# Altium project PositionMiniModule.PrjPcb
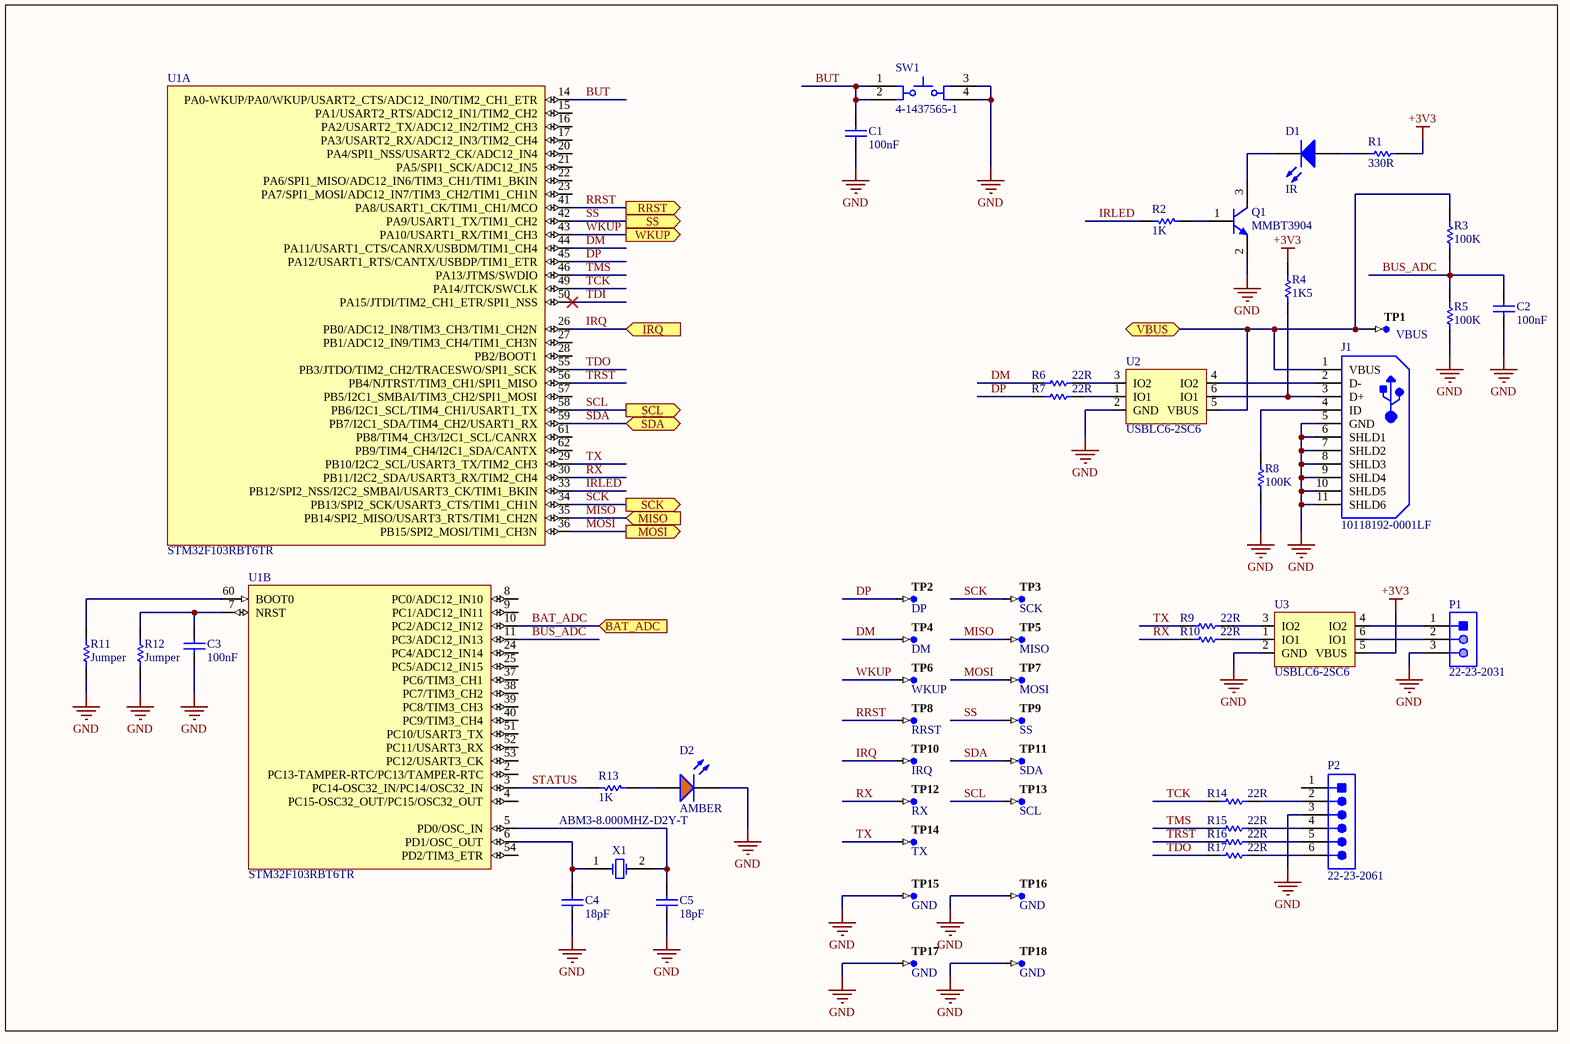
[diagram p0: 1_MCU.SchDoc]
4 sheets, 90 parts. Net scope: flat (ports and power ports of the same name join across sheets).
Board file: PCB.PcbDoc
Sheets:
  1_MCU.SchDoc
  2_Sensors.SchDoc
  3_Radio.SchDoc
  4_Power.SchDoc

## Sheet 1_MCU.SchDoc
size A4

### Parts
C1  100nF  [CAPC0603(1608)100_M]
C2  100nF  [CAPC0603(1608)100_M]
C3  100nF  [CAPC0603(1608)100_M]
C4  18pF  [CAPC0603(1608)100_M]
C5  18pF  [CAPC0603(1608)100_M]
D1  IR  [Type 3mm]
D2  AMBER  [LTST-C171AKT_V]
J1  10118192-0001LF  [FCI-10118192-0001LF-5_V]
P1  22-23-2031  [MOLX-22-23-2031_V]
P2  22-23-2061  [MOLX-22-23-2061_V]
Q1  MMBT3904  [FAIR-SOT23-3_V]
R1  330R  [RESC0603(1608)_M]
R2  1K  [RESC0603(1608)_M]
R3  100K  [RESC0603(1608)_M]
R4  1K5  [RESC0603(1608)_M]
R5  100K  [RESC0603(1608)_M]
R6  22R  [RESC0603(1608)_M]
R7  22R  [RESC0603(1608)_M]
R8  100K  [RESC0603(1608)_M]
R9  22R  [RESC0603(1608)_M]
R10  22R  [RESC0603(1608)_M]
R11  Jumper  [RESC0805(2012)_M]
R12  Jumper  [RESC0805(2012)_M]
R13  1K  [RESC0603(1608)_M]
R14  22R  [RESC0603(1608)_M]
R15  22R  [RESC0603(1608)_M]
R16  22R  [RESC0603(1608)_M]
R17  22R  [RESC0603(1608)_M]
SW1  4-1437565-1  [TECO-4-1437565-1_V]
TP1  VBUS  [TP-SM-C-100]  (no BOM)
TP2  DP  [TP-SM-C-100]  (no BOM)
TP3  SCK  [TP-SM-C-100]  (no BOM)
TP4  DM  [TP-SM-C-100]  (no BOM)
TP5  MISO  [TP-SM-C-100]  (no BOM)
TP6  WKUP  [TP-SM-C-100]  (no BOM)
TP7  MOSI  [TP-SM-C-100]  (no BOM)
TP8  RRST  [TP-SM-C-100]  (no BOM)
TP9  SS  [TP-SM-C-100]  (no BOM)
TP10  IRQ  [TP-SM-C-100]  (no BOM)
TP11  SDA  [TP-SM-C-100]  (no BOM)
TP12  RX  [TP-SM-C-100]  (no BOM)
TP13  SCL  [TP-SM-C-100]  (no BOM)
TP14  TX  [TP-SM-C-100]  (no BOM)
TP15  GND  [TP-SM-C-100]  (no BOM)
TP16  GND  [TP-SM-C-100]  (no BOM)
TP17  GND  [TP-SM-C-100]  (no BOM)
TP18  GND  [TP-SM-C-100]  (no BOM)
U1  STM32F103RBT6TR  [STM-LQFP64_N]  (parts A,B of 3)
U2  USBLC6-2SC6  [SOT95P280X145-6N]
U3  USBLC6-2SC6  [SOT95P280X145-6N]
X1  ABM3-8.000MHZ-D2Y-T  [ABRA-ABM3-2_V]

### Ports
BAT_ADC (in), IRQ (in), MISO (in), MOSI (out), RRST (out), SCK (out), SCL (out), SDA (bidir), SS (out), VBUS (bidir), WKUP (out)

### Nets
+3V3: R1.2 R4.2 U3.5(VBUS)
GND: C1.2 C2.2 C3.2 C4.1 C5.1 D2.C J1.5(GND) J1.6(SHLD1) J1.7(SHLD2) J1.8(SHLD3) J1.9(SHLD4) J1.10(SHLD5) J1.11(SHLD6) P1.3 P2.3 Q1.2(E) R5.1 R8.1 R11.1 R12.1 SW1.3 SW1.4 TP15.1 TP16.1 TP17.1 TP18.1 U2.2(GND) U3.2(GND)
BAT_ADC: U1.10(PC2/ADC12_IN12) ; port BAT_ADC
BUS_ADC: C2.1 R3.1 R5.2 U1.11(PC3/ADC12_IN13)
BUT: C1.1 SW1.1 SW1.2 U1.14(PA0-WKUP/PA0/WKUP/USART2_CTS/ADC12_IN0/TIM2_CH1_ETR)
DM: R6.1 TP4.1 U1.44(PA11/USART1_CTS/CANRX/USBDM/TIM1_CH4)
DP: R7.1 TP2.1 U1.45(PA12/USART1_RTS/CANTX/USBDP/TIM1_ETR)
IRLED: R2.2 U1.33(PB12/SPI2_NSS/I2C2_SMBAl/USART3_CK/TIM1_BKIN)
IRQ: TP10.1 U1.26(PB0/ADC12_IN8/TIM3_CH3/TIM1_CH2N) ; port IRQ
MISO: TP5.1 U1.35(PB14/SPI2_MISO/USART3_RTS/TIM1_CH2N) ; port MISO
MOSI: TP7.1 U1.36(PB15/SPI2_MOSI/TIM1_CH3N) ; port MOSI
RRST: TP8.1 U1.41(PA8/USART1_CK/TIM1_CH1/MCO) ; port RRST
RX: R10.1 TP12.1 U1.30(PB11/I2C2_SDA/USART3_RX/TIM2_CH4)
SCK: TP3.1 U1.34(PB13/SPI2_SCK/USART3_CTS/TIM1_CH1N) ; port SCK
SCL: TP13.1 U1.58(PB6/I2C1_SCL/TIM4_CH1/USART1_TX) ; port SCL
SDA: TP11.1 U1.59(PB7/I2C1_SDA/TIM4_CH2/USART1_RX) ; port SDA
SS: TP9.1 U1.42(PA9/USART1_TX/TIM1_CH2) ; port SS
STATUS: R13.2 U1.3(PC14-OSC32_IN/PC14/OSC32_IN)
TCK: R14.1 U1.49(PA14/JTCK/SWCLK)
TDI: U1.50(PA15/JTDI/TIM2_CH1_ETR/SPI1_NSS)
TDO: R17.1 U1.55(PB3/JTDO/TIM2_CH2/TRACESWO/SPI1_SCK)
TMS: R15.1 U1.46(PA13/JTMS/SWDIO)
TRST: R16.1 U1.56(PB4/NJTRST/TIM3_CH1/SPI1_MISO)
TX: R9.1 TP14.1 U1.29(PB10/I2C2_SCL/USART3_TX/TIM2_CH3)
WKUP: TP6.1 U1.43(PA10/USART1_RX/TIM1_CH3) ; port WKUP
NetC3_1: C3.1 R12.2 U1.7(NRST)
NetC4_2: C4.2 U1.6(PD1/OSC_OUT) X1.1(X1)
NetC5_2: C5.2 U1.5(PD0/OSC_IN) X1.2(X2)
NetD1_1: D1.1(K) Q1.3(C)
NetD1_2: D1.2(A) R1.1
NetD2_A: D2.A R13.1
NetF1_1: J1.1(VBUS) R3.2 TP1.1 U2.5(VBUS) ; port VBUS
NetJ1_2: J1.2(D-) U2.4(IO2)
NetJ1_3: J1.3(D+) R4.1 U2.6(IO1)
NetJ1_4: J1.4(ID) R8.2
NetP1_1: P1.1 U3.4(IO2)
NetP1_2: P1.2 U3.6(IO1)
NetP2_2: P2.2 R14.2
NetP2_4: P2.4 R15.2
NetP2_5: P2.5 R16.2
NetP2_6: P2.6 R17.2
NetQ1_1: Q1.1(B) R2.1
NetR6_2: R6.2 U2.3(IO2)
NetR7_2: R7.2 U2.1(IO1)
NetR9_2: R9.2 U3.3(IO2)
NetR10_2: R10.2 U3.1(IO1)
NetR11_2: R11.2 U1.60(BOOT0)

Not connected (* = marked no-connect by the designer): P2 1; U1 2(PC13-TAMPER-RTC/PC13/TAMPER-RTC) 4(PC15-OSC32_OUT/PC15/OSC32_OUT) 8(PC0/ADC12_IN10) 9(PC1/ADC12_IN11) 15(PA1/USART2_RTS/ADC12_IN1/TIM2_CH2) 16(PA2/USART2_TX/ADC12_IN2/TIM2_CH3) 17(PA3/USART2_RX/ADC12_IN3/TIM2_CH4) 20(PA4/SPI1_NSS/USART2_CK/ADC12_IN4) 21(PA5/SPI1_SCK/ADC12_IN5) 22(PA6/SPI1_MISO/ADC12_IN6/TIM3_CH1/TIM1_BKIN) 23(PA7/SPI1_MOSI/ADC12_IN7/TIM3_CH2/TIM1_CH1N) 24(PC4/ADC12_IN14) 25(PC5/ADC12_IN15) 27(PB1/ADC12_IN9/TIM3_CH4/TIM1_CH3N) 28(PB2/BOOT1) 37(PC6/TIM3_CH1) 38(PC7/TIM3_CH2) 39(PC8/TIM3_CH3) 40(PC9/TIM3_CH4) 51(PC10/USART3_TX) 52(PC11/USART3_RX) 53(PC12/USART3_CK) 54(PD2/TIM3_ETR) 57(PB5/I2C1_SMBAI/TIM3_CH2/SPI1_MOSI) 61(PB8/TIM4_CH3/I2C1_SCL/CANRX) 62(PB9/TIM4_CH4/I2C1_SDA/CANTX)

### Library data of the parts
C1-C3 = CMP-1035-02589-1: CAP 100nF 25V ±20% 0603 (1608 Metric) Thickness 1mm SMD; Case-EIA: 0603; Tolerance: Â±20%; Case-Metric: 1608; Value: 100nF; Max Thickness: 1 mm; Technology: SMT; Rated Voltage: 25 V
C4 C5 = CMP-1035-00741-1: CAP 18pF 25V ±0.5pF 0603 (1608 Metric) Thickness 1mm SMD; Case-Metric: 1608; Case-EIA: 0603; Tolerance: Â±0.5pF; Value: 18pF; Rated Voltage: 25 V; Technology: SMT; Max Thickness: 1 mm
D1 = CMP-1488-00005-1: THT LED round mono-color color lens, WL-TMRW, Super Red; PartNumber: 151031SS04000; Manufacturer: Wuerth Elektronik; ComponentLink2Description: Datasheet; ComponentLink1URL: http://www.we-online.com; ComponentLink1Description: Manufacturer URL; PackageReference: Type 3mm; ComponentLink2URL: http://katalog.we-online.de/pbs/datasheet/7448042001.pdfhttp://katalog.we-online.de/pbs/datasheet/7448042001.pdfhttp://katalog.we-online.de/pbs/datasheet/7448042001.pdfhttp://katalog.we-online.de/pbs/datasheet/151031SS04000.pdf; Emitting color: Super Red
D2 = CMP-1674-00004-3: LED AMBER CLR THIN 0805 SMD; PartNumber: LTST-C171AKT; Manufacturer: Lite-On; ComponentLink1URL: http://optoelectronics.liteon.com/upload/download/DS-22-99-0170/S_110_LTST-C171AKT.pdf; PackageReference: C171AKT; ComponentLink1Description: Datasheet
J1 = CMP-2000-05118-1: Micro USB B Type Receptacle, -55 to 85 degC, 5-Pin SMD, RoHS, Tape and Reel; Manufacturer: FCI; Current Rating: 1.8A; Number of Contacts: 5Contact; Mounting Angle: Right; Insulation Resistance: 1000MOhms; Connector Type: MicroUSBTypeBreceptacle; Gender: Female; Packaging: Reel; Termination Style: SMD/SMT; Product Category: USBConnectors; RoHS: Details; Flammability Rating: UL94V-0; Standard: USB2.0; Brand: FCI; Manufacturer URL: http://www.fci.com/; Product: MicroUSBTypeBConnectors; Operating Temperature Range: -55Cto+85C; Datasheet Version: Rev. B, 05/2015; Contact Material: CopperAlloy; Contact Plating: Gold; Datasheet URL: http://www.mouser.com/ds/2/154/10118192-793027.pdf; Color: Black; Factory Pack Quantity: 1400
P1 = CMP-2000-05242-1: Male Header, Pitch 2.54 mm, 1 x 3 Position, Height 8.18 mm, Tail Length 3.56 mm, RoHS, Bulk; Current Rating: 4A; Brand: Molex; Pitch: 2.54mm; Voltage Rating: 250V; Mounting Angle: Vertical; Type: Locking; Factory Pack Quantity: 16000; Tradename: KK; Housing Material: Nylon; Contact Material: Brass; Manufacturer URL: http://www.molex.com/; Termination Style: ThroughHole; Mounting Style: ThroughHole; Number of Positions: 3Position; Contact Gender: Pin(Male); Packaging: Bulk; Series: 6373; Datasheet Version: Sep-01; Contact Plating: Tin; Product: Headers; Datasheet URL: https://datasheet.ciiva.com/19472/232274-19472863.pdf; RoHS: Details; Product Category: Headers&WireHousings; Manufacturer: Molex; Number of Rows: 1Row
P2 = CMP-2000-05536-1: Male Header, Pitch 2.54 mm, 1 x 6 Position, Height 10.67 mm, Tail Length 3.56 mm, 0 to 70 degC, RoHS, Bulk; Manufacturer: Molex; Pitch: 2.54mm; Mounting Angle: Vertical; Current Rating: 4A; Number of Positions / Contacts: 6; Voltage Rating: 250V; Packaging: Bulk; Package Description: Male Header, Pitch 2.54 mm, 1 x 6 Position, Height 10.67 mm, Tail Length 3.56 mm; Number of Rows: 1; Type: PinStrip; Contact Material: Brass; Product Category: .100K.K.Connectors; Factory Pack Quantity: 1000; Mounting Style: ThroughHole; RoHS: Details; Contact Plating: Tin; Housing Material: Nylon; Mounting Technology: ThroughHole; Termination Style: ThroughHole; Tradename: KK; Number of Positions: 6; Brand: Molex; Product Type: Headers; Series: 6373; Datasheet URL: https://datasheet.ciiva.com/19460/232303-19460895.pdf; Package Reference: 22-23-2061; Datasheet Version: Rev. P, 09/2001; Manufacturer URL: http://www.molex.com/
Q1 = CMP-1670-00008-1: NPN General Purpose Amplifier, 40 V, 0.2 A, -55 to 150 degC, 3-Pin SOT23, RoHS, Tape and Reel; Tolerance: 30ppm; Capacitance: 1.8E-11 f; Frequency: 12.288 MHz; ESR: 40 Ohm; Load Capacitance: 18 pF; REACH SVHC: No SVHC; Pins: 4; ComponentLink3URL: http://www.fairchildsemi.com/dwg/MA/MA03D.pdf; PackageDescription: 3-Pin Small Outline Transistor, Body 2.92 x 1.325 mm, Pitch 0.95 mm; ComponentLink1URL: https://www.fairchildsemi.com/; Max Operating Temperature: 70degC; PackageReference: SOT23-3; ComponentLink1Description: Manufacturer URL; Width: 0.126 inch; Min Operating Temperature: -20degC; DatasheetVersion: Rev. 1.1.0, 10/2014; Mount: Surface Mount; Height: 0.041 inch; Package Quantity: 1000; Frequency Tolerance: 30ppm; Packaging: Tape and Reel; ComponentLink2URL: https://www.fairchildsemi.com/datasheets/MM/MMBT3904.pdf; RoHSCompliant: True; ComponentLink3Description: Package Specification; ComponentLink2Description: Datasheet; Length: 0.197 inch
R1 = CMP-1012-00454-1: 330R 0.1W 1% 0603 (1608 Metric)  SMD; Case-Metric: 1608; Value: 330.00 Ohm; Case-EIA: 0603; Tolerance: 1 %; Technology: SMT; Power: 0.1 W
R2 R13 = CMP-1012-00510-1: 1K 0.1W 1% 0603 (1608 Metric)  SMD; Case-Metric: 1608; Case-EIA: 0603; Value: 1000.00 Ohm; Technology: SMT; Tolerance: 1 %; Power: 0.1 W
R3 R5 R8 = CMP-1012-00736-1: 100K 0.1W 1% 0603 (1608 Metric)  SMD; Value: 100000.00 Ohm; Case-Metric: 1608; Case-EIA: 0603; Power: 0.1 W; Tolerance: 1 %; Technology: SMT
R4 = CMP-1012-00528-1: 1K5 0.1W 1% 0603 (1608 Metric)  SMD; Case-EIA: 0603; Value: 1500.00 Ohm; Case-Metric: 1608; Power: 0.1 W; Technology: SMT; Tolerance: 1 %
R6 R7 R9 R10 R14-R17 = CMP-1012-00320-1: 22R 0.1W 1% 0603 (1608 Metric)  SMD; Value: 22.00 Ohm; Case-EIA: 0603; Case-Metric: 1608; Power: 0.1 W; Technology: SMT; Tolerance: 1 %
R11 R12 = CMP-1013-00001-1: Jumper 0805 (2012 Metric); Case-EIA: 0805; Value: 0.00 Ohm; Tolerance: None; Case-Metric: 2012; Technology: SMT; Power: None
SW1 = CMP-2000-05602-1: Tactile Switch, 50 mA, 12 VDC, -20 to 85 degC, 4-Pin SMD, RoHS, Bulk; Manufacturer: TEConnectivity/AMPBrand; Illumination Type: N/R; Maximum Contact Resistance: 100mOhm; Actuator Style: RoundButton; Actuator Length: 1.4mm; Contact Rating @ Voltage: 0.05@12VDCA; Maximum DC Voltage Rating: 12V; Body Orientation: Straight; Ground Terminal: No; Dielectric Strength: 500VAC; Operating Force: 1.57N; Electrical Life: 100000Cycle; Mechanical Life: N/A; Family: FSMJSMA; Contact Material: CopperAlloy; Type: N/A; RoHS: Yes; Pole Throw Configuration: N/A; Operating Temperature: -20to85C; Minimum Insulation Resistance: 100MOhm; Package Description: 4-Pin Surface Mount Device, Body 6 x 6 mm, Pitch 9.1 mm; Housing Material: N/A; Switch Configuration: N/A; Mounting: SurfaceMount,GullWing; Datasheet URL: https://datasheet.ciiva.com/14635/0900766b80912216-14635826.pdf; Packaging: Bulk; Base Material: N/A; Actuator Color: N/A; Dimension: 6x10x5.25mm; Contact Plating: Silver; Seal Location: N/A; Mounting Technology: SurfaceMount; Part No: 4-1437565-1; Seal Description: N/A; Maximum AC Voltage Rating: N/A; Datasheet Version: 04/2007; Manufacturer URL: http://www.te.com/; Package Reference: 4-1437565-1; Product Weight: N/A
TP1-TP18 = CMP-0484-00002-2: Test Point, Surface Mount, Circular, Pad Diameter 1 mm; Manufacturer: No Vendor; PartNumber: TP-SM-C-100
U1 = CMP-0237-00169-2: ARM Cortex-M3 32-bit MCU, 128 KB Flash, 20 KB Internal RAM, 51 I/Os, 64-pin LQFP, -40 to 85 degC, Tape and Reel; Supply Voltage(Vcc) min (V): 2; A/D Converter: 2x12-bit (16 Channel); FLASH Size (Prog) (kB): 128; I/Os (High Current): 51; Operating Frequency(F) (Processor speed) (MHz): 72; Internal RAM Size (kB): 20; ComponentLink2URL: http://www.st.com/st-web-ui/static/active/en/resource/technical/document/datasheet/CD00161566.pdf; ComponentLink2Description: Datasheet; ComponentLink1Description: Manufacturer URL; Packing: Tape and Reel; PackageReference: LQFP64; ComponentLink1URL: http://www.st.com/web/en/home.html; Mounting Technology: Surface Mount; DatasheetVersion: Rev. 16; PartNumber: STM32F103RBT6TR; Core: ARM Cortex-M3; ComponentLink3URL: http://www.st.com/st-web-ui/static/active/en/resource/technical/document/datasheet/DM00037051.pdf; PackageDescription: 64-Pin Low Profile Quad Flat Package, 10 x 10 mm Body, 0.5 mm Pitch; PackageVersion: Rev. 4, 06/2013; ComponentLink3Description: Package Specification; PartId: 1
U2 U3 = USBLC6-2SC6: TVS DIODE 5.25V 17V SOT23-6; Manufacturer: STMicroelectronics; Direction: Unidirectional; Capacitance: 3.5pF; Number of Bidirectional Channels: 2; Min Breakdown Voltage: 6V; Power Line Protection: Yes; Leakage Current: 150nA; Peak Pulse Current: 5A; Operating Supply Voltage: 1.1V; Test Current: 1mA; Number of Elements: 1; Working Voltage: 5V; Element Configuration: Dual; Data Rate: 480Mbps; Supplier 1: Digi-Key; Manufacturer Part Number: USBLC6-2SC6; Stock 1: 85571; Pricing 1: 1 = 0,49000, 10 = 0,41900, 100 = 0,31310, 500 = 0,24602, 1000 = 0,19010 (USD); RoHS: Yes; Mount: Surface Mount; Case/Package: SOT-23; Number of Pins: 6; Contact Plating: Tin; Min Operating Temperature: -40°C; Max Operating Temperature: 125°C; Packaging: Tape and Reel; Package Quantity: 3000; Clamping Voltage: 17V; Reverse Standoff Voltage: 5.25V; Number of Channels: 2; Breakdown Voltage: 6V; Termination: SMD/SMT; ESD Protection: Yes; Max Reverse Leakage Current: 150nA; Reverse Breakdown Voltage: 6V; Polarity: Unidirectional; Max Breakdown Voltage: 6V; Length: 3.05mm; Height: 1.3mm; Depth: 1.75mm; Width: 1.75mm; Radiation Hardening: No; Lead Free: Lead Free; REACH SVHC: No SVHC; ComponentLink1URL: https://datasheet.ciiva.com/1268/1690354-1268384.pdf?src-supplier=Element14; ComponentLink1Description: https://datasheet.ciiva.com/1268/1690354-1268384.pdf?src-supplier=Element14; ComponentLink2URL: https://datasheet.ciiva.com/4508/cd00050750-113117-4508433.pdf?src-supplier=Mouser; ComponentLink2Description: https://datasheet.ciiva.com/4508/cd00050750-113117-4508433.pdf?src-supplier=Mouser; ComponentLink3URL: https://datasheet.ciiva.com/15143/getdatasheetpartid-148465-15143789.pdf?src-supplier=Verical; ComponentLink3Description: https://datasheet.ciiva.com/15143/getdatasheetpartid-148465-15143789.pdf?src-supplier=Verical; ComponentLink4URL: https://datasheet.ciiva.com/26787/usblc6-2sc6-26787908.pdf?src-supplier=IIIC; ComponentLink4Description: https://datasheet.ciiva.com/26787/usblc6-2sc6-26787908.pdf?src-supplier=IIIC; ComponentLink5URL: https://datasheet.ciiva.com/16200/cd00050750-16200026.pdf?src-supplier=Future+Electronics; ComponentLink5Description: https://datasheet.ciiva.com/16200/cd00050750-16200026.pdf?src-supplier=Future+Electronics; ComponentLink6URL: https://datasheet.ciiva.com/41444/001184109-da-01-en-ic-esd-protecti-usblc6-2sc6-sot-23-6-stm-41444156.pdf?src-supplier=Conrad; ComponentLink6Description: https://datasheet.ciiva.com/41444/001184109-da-01-en-ic-esd-protecti-usblc6-2sc6-sot-23-6-stm-41444156.pdf?src-supplier=Conrad
X1 = CMP-2000-05033-1: Miniature Ceramic Crystal, 8 MHz, -40 to 85 degC, 2-Pin SMD, RoHS, Tape and Reel; Manufacturer: ABRACON; Case Length: 5mm; Case Width: 3.2mm; Case Height: 1.3mm; Load Capacitance: 18pF; Frequency: 8MHz; Frequency Stability: 30PPM; ESR: 140Ohms; Tolerance: 20PPM; Type: MiniatureCeramicCrystal; Factory Pack Quantity: 1000; Package / Case: 5mmx3.2mm; Mounting Style: SMD/SMT; Manufacturer URL: http://www.abracon.com/; RoHS: Details; Dimensions: 3.2mmWx5mmLx1.3mmH; Datasheet URL: http://www.farnell.com/datasheets/1754353.pdf; Brand: ABRACON; Packaging: Reel; Product Category: Crystals; Package Description: 2-Pin Surface Mount Device, Body 5 x 3.2 mm; Package URL: http://www.abracon.com/Support/PackageDrawing/Resonators/ABM3.PDF; Operating Temperature Range: -40Cto+85C; Termination Style: SMD/SMT; Datasheet Version: Sep-13; Series: ABM3; Package Reference: ABM3-2

## Sheet 2_Sensors.SchDoc
size A4
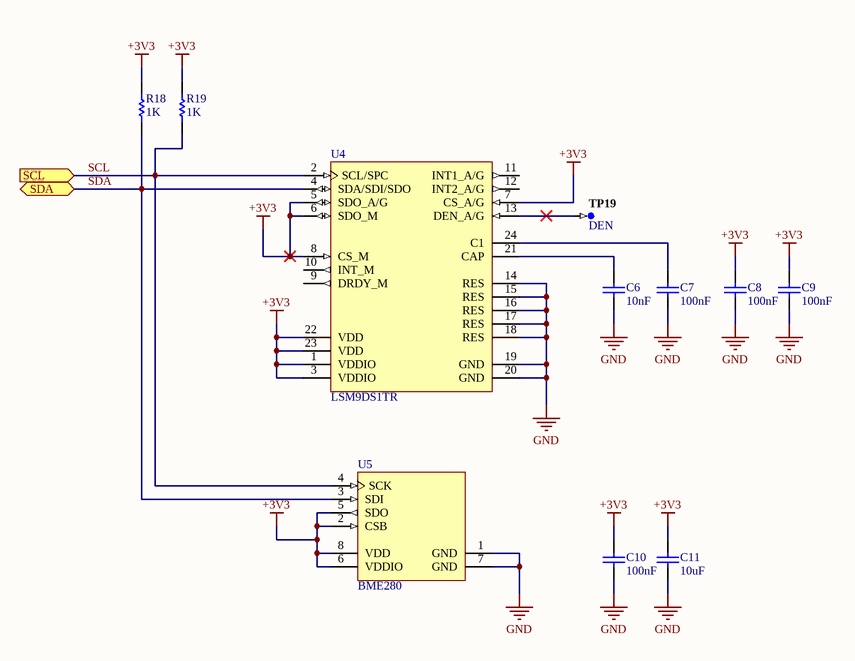
[diagram p1: 2_Sensors.SchDoc]

### Parts
C6  10nF  [CAPC0603(1608)100_M]
C7  100nF  [CAPC0603(1608)100_M]
C8  100nF  [CAPC0603(1608)100_M]
C9  100nF  [CAPC0603(1608)100_M]
C10  100nF  [CAPC0603(1608)100_M]
C11  10uF  [CAPC1206(3216)130_L]
R18  1K  [RESC0603(1608)_M]
R19  1K  [RESC0603(1608)_M]
TP19  DEN  [TP-SM-C-100]  (no BOM)
U4  LSM9DS1TR  [STM-LGA-24_3500X3000X1000]
U5  BME280  [BOSC-BME280-8_V]

### Ports
SCL (in), SDA (bidir)

### Nets
+3V3: C8.1 C9.1 C10.1 C11.2 R18.2 R19.2 U4.1(VDDIO) U4.3(VDDIO) U4.5(SDO_A/G) U4.6(SDO_M) U4.7(CS_A/G) U4.8(CS_M) U4.22(VDD) U4.23(VDD) U5.2(CSB) U5.5(SDO) U5.6(VDDIO) U5.8(VDD)
GND: C6.1 C7.2 C8.2 C9.2 C10.2 C11.1 U4.14(RES) U4.15(RES) U4.16(RES) U4.17(RES) U4.18(RES) U4.19(GND) U4.20(GND) U5.1(GND) U5.7(GND)
SCL: R19.1 U4.2(SCL/SPC) U5.4(SCK) ; port SCL
SDA: R18.1 U4.4(SDA/SDI/SDO) U5.3(SDI) ; port SDA
NetC6_2: C6.2 U4.21(CAP)
NetC7_1: C7.1 U4.24(C1)
NetTP19_1: TP19.1 U4.13(DEN_A/G)

Not connected (* = marked no-connect by the designer): U4 9(DRDY_M) 10(INT_M) 11(INT1_A/G) 12(INT2_A/G)

### Library data of the parts
C6 = CMP-1035-02316-1: CAP 10nF 25V ±5% 0603 (1608 Metric) Thickness 1mm SMD; Tolerance: Â±5%; Case-EIA: 0603; Case-Metric: 1608; Rated Voltage: 25 V; Technology: SMT; Max Thickness: 1 mm; Value: 10nF
C7-C10 = CMP-1035-02589-1: as C1 on sheet 1_MCU; Value: 100nF; Max Thickness: 1 mm; Technology: SMT; Rated Voltage: 25 V
C11 = CMP-1037-04977-1: CAP 10uF 16V -20% to +80% 1206 (3216 Metric) Thickness 1.3mm SMD; Case-EIA: 1206; Case-Metric: 3216; Rated Voltage: 16 V; Tolerance: -20% to +80%; Technology: SMT; Value: 10uF; Max Thickness: 1.3 mm
R18 R19 = CMP-1012-00510-1: as R2 on sheet 1_MCU; Technology: SMT; Tolerance: 1 %; Power: 0.1 W
TP19 = CMP-0484-00002-2: as TP1 on sheet 1_MCU; PartNumber: TP-SM-C-100
U4 = CMP-2000-06606-1: iNEMO Inertial Module: 3D Accelerometer, 3D Gyroscope, 3D Magnetometer, 1.9 to 3.6 V, -40 to 85 degC, 24-Pin LGA, RoHS, Tape and Reel; Manufacturer: STMicroelectronics; SVHC: NoSVHC(17-Dec-2015); MEMS Module Function: Tri-AxisGyroscope,Tri-AxisAccelerometer,Tri-AxisMagnetometer; Supply Voltage Max: 3.6V; No. of Pins: 24Pins; Gyroscope Range: ±245°/s,±500°/s,±2000°/s; Acceleration Range: ±2g,±4g,±8g,±16g; Supply Voltage Min: 1.9V; Package Description: 24-Pin Plastic Land Grid Array Package, Body 3.65 x 3.15 mm, Pitch 0.43 mm; Manufacturer URL: http://www.st.com/; PartNumber: LSM9DS1; Product Range: -; Packaging: CutTape; Sensor Case Style: LGA; Datasheet URL: http://www2.st.com/content/ccc/resource/technical/document/datasheet/1e/3f/2a/d6/25/eb/48/46/DM00103319.pdf/files/DM00103319.pdf/jcr:content/translations/en.DM00103319.pdf; Package Reference: LGA-24_3500X3000X1000; Mounting Technology: SurfaceMount; Datasheet Version: Rev. 3, 03/2015; MSL: MSL3-168hours
U5 = CMP-2000-05073-1: Combined Humidity and Pressure Sensor, 1.71 to 3.6 V, -40 to 85 degC, 8-Pin SMD, RoHS, Tape and Reel; Manufacturer: Bosch Sensortec; Datasheet Version: Rev. 1.2, 10/2015; Datasheet URL: http://datasheet.octopart.com/BME280-Bosch-datasheet-58577763.pdf; Manufacturer URL: http://www.bosch-sensortec.com

## Sheet 3_Radio.SchDoc
size A4
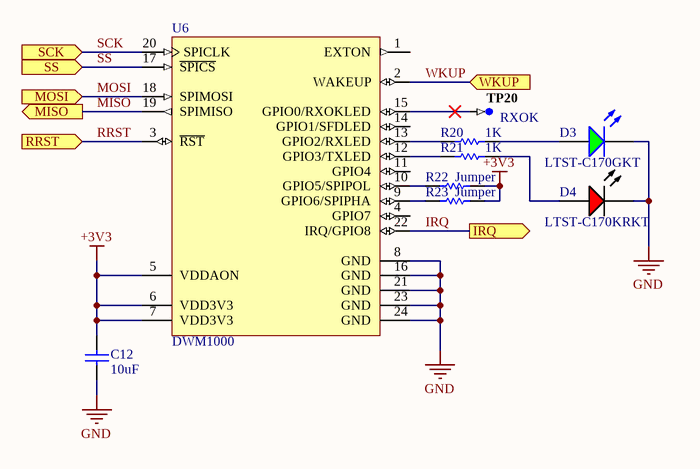
[diagram p2: 3_Radio.SchDoc]

### Parts
C12  10uF  [CAPC1206(3216)130_L]
D3  LTST-C170GKT  [LTST-C170GKT_V]
D4  LTST-C170KRKT  [LTST-C170KRKT_V]
R20  1K  [RESC0603(1608)_M]
R21  1K  [RESC0603(1608)_M]
R22  Jumper  [RESC0805(2012)_M]
R23  Jumper  [RESC0805(2012)_M]
TP20  RXOK  [TP-SM-C-100]  (no BOM)
U6  DWM1000  [DECW-DWM1000-24_V]

### Ports
IRQ (out), MISO (out), MOSI (in), RRST (in), SCK (in), SS (in), WKUP (in)

### Nets
+3V3: C12.2 R22.1 R23.1 U6.5(VDDAON) U6.6(VDD3V3) U6.7(VDD3V3)
GND: C12.1 D3.C D4.2(K) U6.8(GND) U6.16(GND) U6.21(GND) U6.23(GND) U6.24(GND)
IRQ: U6.22(IRQ/GPIO8) ; port IRQ
MISO: U6.19(SPIMISO) ; port MISO
MOSI: U6.18(SPIMOSI) ; port MOSI
RRST: U6.3(~{RST}) ; port RRST
SCK: U6.20(SPICLK) ; port SCK
SS: U6.17(~{SPICS}) ; port SS
WKUP: U6.2(WAKEUP) ; port WKUP
NetD3_A: D3.A R20.1
NetD4_1: D4.1(A) R21.1
NetR20_2: R20.2 U6.13(GPIO2/RXLED)
NetR21_2: R21.2 U6.12(GPIO3/TXLED)
NetR22_2: R22.2 U6.10(GPIO5/SPIPOL)
NetR23_2: R23.2 U6.9(GPIO6/SPIPHA)
NetTP20_1: TP20.1 U6.15(GPIO0/RXOKLED)

Not connected (* = marked no-connect by the designer): U6 1(EXTON) 4(GPIO7) 11(GPIO4) 14(GPIO1/SFDLED)

### Library data of the parts
C12 = CMP-1037-04977-1: as C11 on sheet 2_Sensors; Rated Voltage: 16 V; Tolerance: -20% to +80%; Technology: SMT; Value: 10uF; Max Thickness: 1.3 mm
D3 = CMP-1674-00002-3: LED GREEN CLEAR 0805 SMD; Manufacturer: Lite-On; ComponentLink1URL: http://media.digikey.com/pdf/Data%20Sheets/Lite-On%20PDFs/LTST-C170GKT.pdf; PackageReference: C170GKT; ComponentLink1Description: Datasheet; PartNumber: LTST-C170GKT
D4 = CMP-2000-07593-1: LED Red, 75 mW, 54 mcd, -55 to 85 degC, 2-Pin SMD, RoHS, Tape and Reel; Manufacturer: Lite-On; Lens Transparency: Clear; Number of Elements: 1; Power Rating: 75mW; Luminous Intensity: 54mcd; Viewing Angle: 130degrees; Forward Current: 30mA; Wavelength: 639nm; Lens Style: Rectangular; Case\/Package: 0805; Test Current: 20mA; Dominant Wavelength: 631nm; Forward Voltage: 2V; Lens Colour: Colorless; Min Operating Temperature: -55degC; RoHSCompliant: True; Length: 3.2mm; Width: 1.25mm; Mount: SurfaceMount; Packaging: TapeandReel; Number of LEDs: 1; Radiation Hardening: No; Datasheet URL: http://optoelectronics.liteon.com/upload/download/DS-22-99-0150/LTST-C170KRKT.pdf; Datasheet Version: Rev. D, 11/2014; Case Code (Metric): 2012; Height: 1.1mm; Number of Pins: 2; Package Description: 2-Pin Surface Mount Device, Body 2 x 1.25 mm; Manufacturer URL: http://www.us.liteon.com/; Lead Free: LeadFree; Illumination Colour: Red; Colour: Red; Case Code (Imperial): 0805; Max Operating Temperature: 85degC; Power Dissipation: 75mW; Mounting Technology: SurfaceMount; Package Reference: C170KRKT; Package Quantity: 1; Depth: 1.6mm
R20 R21 = CMP-1012-00510-1: as R2 on sheet 1_MCU; Technology: SMT; Tolerance: 1 %; Power: 0.1 W
R22 R23 = CMP-1013-00001-1: as R11 on sheet 1_MCU; Technology: SMT; Power: None
TP20 = CMP-0484-00002-2: as TP1 on sheet 1_MCU; PartNumber: TP-SM-C-100
U6 = CMP-2000-05094-1: DW M1000 IEEE 802.15.4 -2011 UWB Transceiver Module; Manufacturer: Decawave; Voltage - Supply: 2.8V~3.6V; Protocol: IR-UWB; Featured Product: ScenSorDWM1000Module; Design Resources: DevelopmentToolSelector; Frequency: 3.5GHz~6.5GHz; Antenna Type: Integrated,Chip; Other Names: 1479-1002-2RUPF-G001A; Current - Receiving: 64mA; Data Rate: 6.8Mbps; Serial Interfaces: SPI; Current - Transmitting: 31mA; Modulation: BPM,BPSK; Standard Package: 500; Series: -; RF Family/Standard: 802.15.4; Operating Temperature: -40degC~85degC; Sensitivity: -; Packaging: Tape&Reel(TR); Datasheet Version: Rev. V1.0, 12/2015; Power - Output: -; Family: RFTransceiverModules; Memory Size: -; Package / Case: Module; Mounting Type: SurfaceMount; Datasheet URL: http://www.decawave.com/sites/default/files/resources/dwm1000-datasheet-v1.3.pdf; Online Catalog: ScenSorDWM1000Module; Category: RF/IFandRFID; Manufacturer URL: http://www.decawave.com/

## Sheet 4_Power.SchDoc
size A4
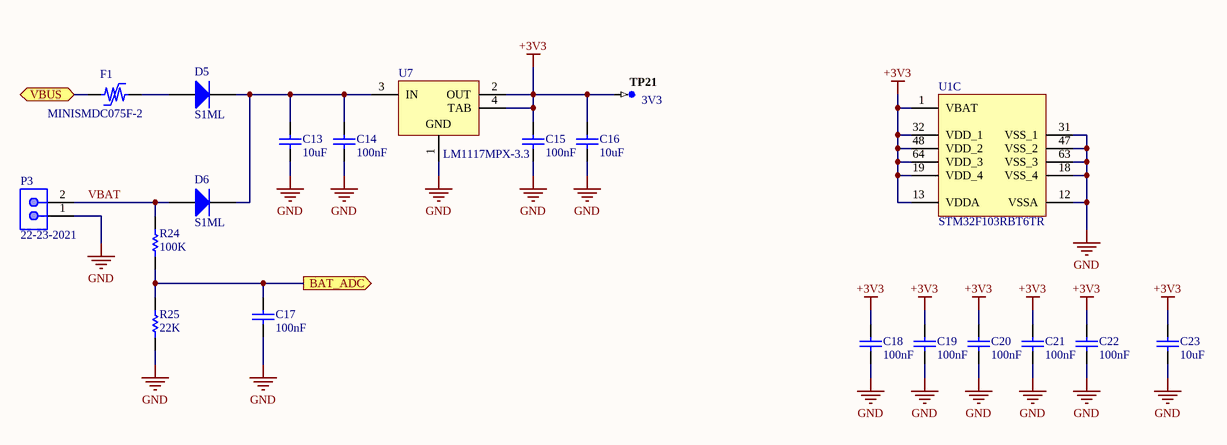
[diagram p3: 4_Power.SchDoc]

### Parts
C13  10uF  [CAPC1206(3216)130_L]
C14  100nF  [CAPC0603(1608)100_M]
C15  100nF  [CAPC0603(1608)100_M]
C16  10uF  [CAPC1206(3216)130_L]
C17  100nF  [CAPC0603(1608)100_M]
C18  100nF  [CAPC0603(1608)100_M]
C19  100nF  [CAPC0603(1608)100_M]
C20  100nF  [CAPC0603(1608)100_M]
C21  100nF  [CAPC0603(1608)100_M]
C22  100nF  [CAPC0603(1608)100_M]
C23  10uF  [CAPC1206(3216)130_L]
D5  S1ML  [TWS-S1ML_V]
D6  S1ML  [TWS-S1ML_V]
F1  MINISMDC075F-2  [TECO-MINISMDC075F_V]
P3  22-23-2021  [MOLX-22-23-2021_V]
R24  100K  [RESC0603(1608)_M]
R25  22K  [RESC0603(1608)_M]
TP21  3V3  [TP-SM-C-100]  (no BOM)
U1  STM32F103RBT6TR  [STM-LQFP64_N]  (part C of 3)
U7  LM1117MPX-3.3  [MP04A_N]

### Ports
BAT_ADC (out), VBUS (bidir)

### Nets
+3V3: C15.2 C16.2 C18.2 C19.2 C20.2 C21.2 C22.2 C23.2 TP21.1 U1.1(VBAT) U1.13(VDDA) U1.19(VDD_4) U1.32(VDD_1) U1.48(VDD_2) U1.64(VDD_3) U7.2(OUT) U7.4(TAB)
GND: C13.1 C14.1 C15.1 C16.1 C17.1 C18.1 C19.1 C20.1 C21.1 C22.1 C23.1 P3.1 R25.1 U1.12(VSSA) U1.18(VSS_4) U1.31(VSS_1) U1.47(VSS_2) U1.63(VSS_3) U7.1(GND)
BAT_ADC: C17.2 R24.1 R25.2 ; port BAT_ADC
VBAT: D6.1(A) P3.2 R24.2
NetC13_2: C13.2 C14.2 D5.2(K) D6.2(K) U7.3(IN)
NetD5_1: D5.1(A) F1.2
NetF1_1: F1.1 ; port VBUS

### Library data of the parts
C13 C16 C23 = CMP-1037-04977-1: as C11 on sheet 2_Sensors; Rated Voltage: 16 V; Tolerance: -20% to +80%; Technology: SMT; Value: 10uF; Max Thickness: 1.3 mm
C14 C15 C17-C22 = CMP-1035-02589-1: as C1 on sheet 1_MCU; Value: 100nF; Max Thickness: 1 mm; Technology: SMT; Rated Voltage: 25 V
D5 D6 = CMP-2000-07014-1: Rectifier, 1 A, 1.1 V, -55 to 175 degC, 2-Pin SMD, RoHS, Tape and Reel; Manufacturer: Taiwan Semiconductor; Forward Current If(AV): 1A; Forward Voltage VF Max: 1.1V; Diode Configuration: Single; Reverse Recovery Time trr Max: 1.8µs; Forward Surge Current Ifsm Max: 30A; SVHC: NoSVHC(15-Jun-2015); Repetitive Reverse Voltage Vrrm Max: 1kV; No. of Pins: 2Pin; Mounting Technology: SurfaceMount; Package Reference: S1ML; Datasheet URL: http://www.taiwansemi.com/products/datasheet/S1AL%20SERIES_O15.pdf; Manufacturer URL: http://www.taiwansemi.com/; Package Description: 2-Pin Surface Mount Device, Body 2.8 x 1.8 mm; Product Range: -; Diode Case Style: SMD; Datasheet Version: Rev. O15, 05/2015; Packaging: CutTape; Operating Temperature Max: 150°C
F1 = CMP-2000-06707-1: PolySwitch Resettable Device, 13.2 V, 0.75 A, -40 to 85 degC, 2-Pin SMD, RoHS, Tape and Reel; Manufacturer: TE Connectivity; Product Range: PolySwitchminiSMDCSeries; Voltage Rating: 13.2VDC; Operating Voltage: 13.2 / V; Initial Resistance Max: 0.45 / ohm; SVHC: NoSVHC(15-Jun-2015); Holding Current: 750mA; Tripping Current: 1.5A; Operating Temperature Max: 85°C; Package Reference: MINISMDC075F; Package Description: 2-Pin Surface Mount Device, Body 4.55 x 3.24 mm; Thermistor Mounting: SMD; PTC Fuse Case Style: SMD; Manufacturer URL: http://www.te.com/; Datasheet URL: http://www.te.com/commerce/DocumentDelivery/DDEController?Action=srchrtrv&DocNm=CLP00010&DocType=CS&DocLang=English; Operating Temperature Min: -40°C; Mounting Technology: SurfaceMount; Datasheet Version: 11/2013
P3 = CMP-1704-00001-1: Male Header, Pitch 2.54 mm, 1 x 2 Position, Height 10.67 mm, Tail Length 3.56 mm, 0 to 75 degC, RoHS, Bulk; Manufacturer: Molex; PackageDescription: Male Header, Pitch 2.54 mm, 1 x 2 Position, Height 10.67 mm, Tail Length 3.56 mm; ComponentLink2URL: https://datasheet.ciiva.com/19454/232266-19454304.pdf; ComponentLink2Description: Datasheet; ComponentLink1Description: Manufacturer URL; PartNumber: 22-23-2021; Mounting Technology: Through Hole; ComponentLink1URL: http://www.molex.com/; PackageReference: 22-23-2021
R24 = CMP-1012-00736-1: as R3 on sheet 1_MCU; Power: 0.1 W; Tolerance: 1 %; Technology: SMT
R25 = CMP-1012-00659-1: 22K 0.1W 1% 0603 (1608 Metric)  SMD; Case-EIA: 0603; Value: 22000.00 Ohm; Case-Metric: 1608; Technology: SMT; Power: 0.1 W; Tolerance: 1 %
TP21 = CMP-0484-00002-2: as TP1 on sheet 1_MCU; PartNumber: TP-SM-C-100
U1 = CMP-0237-00169-2: as U1 on sheet 1_MCU; ComponentLink2URL: http://www.st.com/st-web-ui/static/active/en/resource/technical/document/datasheet/CD00161566.pdf; ComponentLink2Description: Datasheet; ComponentLink1Description: Manufacturer URL; Packing: Tape and Reel; PackageReference: LQFP64; ComponentLink1URL: http://www.st.com/web/en/home.html; Mounting Technology: Surface Mount; DatasheetVersion: Rev. 16; PartNumber: STM32F103RBT6TR; Core: ARM Cortex-M3; ComponentLink3URL: http://www.st.com/st-web-ui/static/active/en/resource/technical/document/datasheet/DM00037051.pdf; PackageDescription: 64-Pin Low Profile Quad Flat Package, 10 x 10 mm Body, 0.5 mm Pitch; PackageVersion: Rev. 4, 06/2013; ComponentLink3Description: Package Specification; PartId: 1
U7 = CMP-0062-01659-3: 800mA Low-Dropout Linear Regulator, 4-pin SOT-223; Manufacturer: National Semiconductor; PowerWise: N; High-Reliability: Y; PackageTopMarking: XYTT*N05A; CompType: LDO IC; DatasheetVersion: Apr-2006; PackageDescription: Molded SOT-223, 6.50 x 3.56 x 1.6mm Body, 4 Lead, 2.3mm Pitch; ComponentLink1Description: Manufacturer URL; ComponentLink4Description: MP04A Package Page; PartNumber: LM1117MPX-3.3; ComponentLink3URL: http://www.national.com/pf/LM/LM1117.html; ComponentLink2Description: LM1117 Datasheet; Code_JEDEC: TO-261-AA; ComponentLink4URL: http://www.national.com/packaging/folders/mp04a.html; Code_IPC: SOT223-4; RevisionNote: SCH symbol layout adjusted; PackageVersion: revB, Apr-2003; RoHS: N; PackageReference: MP04A; ComponentLink1URL: http://www.national.com/; ComponentLink2URL: http://www.national.com/ds/LM/LM1117.pdf; PinCount: 4; ComponentLink3Description: LM1117 Web Page

## Nets that join several sheets
+3V3: 1_MCU (R1.2 R4.2 U3.5), 2_Sensors (18 pins), 3_Radio (6 pins), 4_Power (17 pins)
GND: 1_MCU (28 pins), 2_Sensors (15 pins), 3_Radio (8 pins), 4_Power (19 pins)
BAT_ADC: 1_MCU (U1.10), 4_Power (C17.2 R24.1 R25.2)
IRQ: 1_MCU (TP10.1 U1.26), 3_Radio (U6.22)
MISO: 1_MCU (TP5.1 U1.35), 3_Radio (U6.19)
MOSI: 1_MCU (TP7.1 U1.36), 3_Radio (U6.18)
NetF1_1: 1_MCU (J1.1 R3.2 TP1.1 U2.5), 4_Power (F1.1)
RRST: 1_MCU (TP8.1 U1.41), 3_Radio (U6.3)
SCK: 1_MCU (TP3.1 U1.34), 3_Radio (U6.20)
SCL: 1_MCU (TP13.1 U1.58), 2_Sensors (R19.1 U4.2 U5.4)
SDA: 1_MCU (TP11.1 U1.59), 2_Sensors (R18.1 U4.4 U5.3)
SS: 1_MCU (TP9.1 U1.42), 3_Radio (U6.17)
WKUP: 1_MCU (TP6.1 U1.43), 3_Radio (U6.2)